# Vivado block design counter_4, xc7a35tcpg236-1, Vivado 2019.1
# (continued, part 2 of 2)
current_bd_instance /JK_FF_2/DFF/nand_3_1
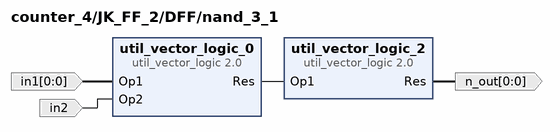
[diagram p24: block diagram inside /JK_FF_2/DFF/nand_3_1]
create_bd_pin -dir I -from 0 -to 0 in1
create_bd_pin -dir I in2
create_bd_pin -dir O -from 0 -to 0 n_out

create_bd_cell -type ip -vlnv xilinx.com:ip:util_vector_logic:2.0 util_vector_logic_0
set_property -dict {CONFIG.C_OPERATION and CONFIG.C_SIZE 1} [get_bd_cells util_vector_logic_0]
create_bd_cell -type ip -vlnv xilinx.com:ip:util_vector_logic:2.0 util_vector_logic_2
set_property -dict {CONFIG.C_OPERATION not CONFIG.C_SIZE 1} [get_bd_cells util_vector_logic_2]

# ---- hierarchy /JK_FF_2/DFF/nand_3_2 ----
current_bd_instance /JK_FF_2/DFF/nand_3_2
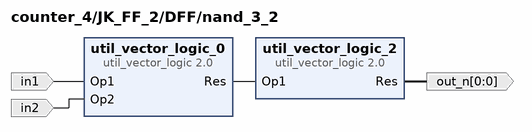
[diagram p25: block diagram inside /JK_FF_2/DFF/nand_3_2]
create_bd_pin -dir I in1
create_bd_pin -dir I in2
create_bd_pin -dir O -from 0 -to 0 out_n

create_bd_cell -type ip -vlnv xilinx.com:ip:util_vector_logic:2.0 util_vector_logic_0
set_property -dict {CONFIG.C_OPERATION and CONFIG.C_SIZE 1} [get_bd_cells util_vector_logic_0]
create_bd_cell -type ip -vlnv xilinx.com:ip:util_vector_logic:2.0 util_vector_logic_2
set_property -dict {CONFIG.C_OPERATION not CONFIG.C_SIZE 1} [get_bd_cells util_vector_logic_2]

# ---- hierarchy /JK_FF_2/DFF/nand_3_3 ----
current_bd_instance /JK_FF_2/DFF/nand_3_3
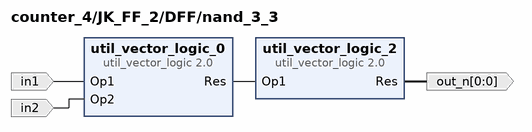
[diagram p26: block diagram inside /JK_FF_2/DFF/nand_3_3]
create_bd_pin -dir I in1
create_bd_pin -dir I in2
create_bd_pin -dir O -from 0 -to 0 out_n

create_bd_cell -type ip -vlnv xilinx.com:ip:util_vector_logic:2.0 util_vector_logic_0
set_property -dict {CONFIG.C_OPERATION and CONFIG.C_SIZE 1} [get_bd_cells util_vector_logic_0]
create_bd_cell -type ip -vlnv xilinx.com:ip:util_vector_logic:2.0 util_vector_logic_2
set_property -dict {CONFIG.C_OPERATION not CONFIG.C_SIZE 1} [get_bd_cells util_vector_logic_2]

# ---- hierarchy /JK_FF_2/DFF/nand_3_4 ----
current_bd_instance /JK_FF_2/DFF/nand_3_4
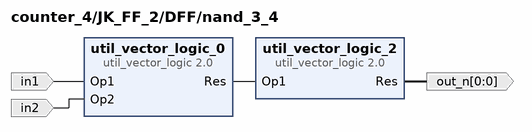
[diagram p27: block diagram inside /JK_FF_2/DFF/nand_3_4]
create_bd_pin -dir I in1
create_bd_pin -dir I in2
create_bd_pin -dir O -from 0 -to 0 out_n

create_bd_cell -type ip -vlnv xilinx.com:ip:util_vector_logic:2.0 util_vector_logic_0
set_property -dict {CONFIG.C_OPERATION and CONFIG.C_SIZE 1} [get_bd_cells util_vector_logic_0]
create_bd_cell -type ip -vlnv xilinx.com:ip:util_vector_logic:2.0 util_vector_logic_2
set_property -dict {CONFIG.C_OPERATION not CONFIG.C_SIZE 1} [get_bd_cells util_vector_logic_2]

# ---- hierarchy /JK_FF_2/DFF/nand_3_5 ----
current_bd_instance /JK_FF_2/DFF/nand_3_5
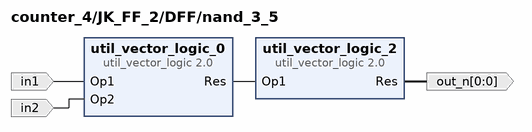
[diagram p28: block diagram inside /JK_FF_2/DFF/nand_3_5]
create_bd_pin -dir I in1
create_bd_pin -dir I in2
create_bd_pin -dir O -from 0 -to 0 out_n

create_bd_cell -type ip -vlnv xilinx.com:ip:util_vector_logic:2.0 util_vector_logic_0
set_property -dict {CONFIG.C_OPERATION and CONFIG.C_SIZE 1} [get_bd_cells util_vector_logic_0]
create_bd_cell -type ip -vlnv xilinx.com:ip:util_vector_logic:2.0 util_vector_logic_2
set_property -dict {CONFIG.C_OPERATION not CONFIG.C_SIZE 1} [get_bd_cells util_vector_logic_2]

# ---- hierarchy /JK_FF_2/DFF/nand_3_6 ----
current_bd_instance /JK_FF_2/DFF/nand_3_6
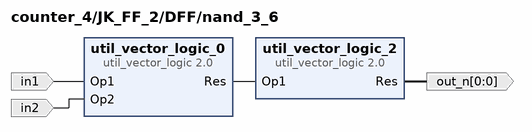
[diagram p29: block diagram inside /JK_FF_2/DFF/nand_3_6]
create_bd_pin -dir I in1
create_bd_pin -dir I in2
create_bd_pin -dir O -from 0 -to 0 out_n

create_bd_cell -type ip -vlnv xilinx.com:ip:util_vector_logic:2.0 util_vector_logic_0
set_property -dict {CONFIG.C_OPERATION and CONFIG.C_SIZE 1} [get_bd_cells util_vector_logic_0]
create_bd_cell -type ip -vlnv xilinx.com:ip:util_vector_logic:2.0 util_vector_logic_2
set_property -dict {CONFIG.C_OPERATION not CONFIG.C_SIZE 1} [get_bd_cells util_vector_logic_2]

# ---- hierarchy /JK_FF_2/DFF/nand_3_7 ----
current_bd_instance /JK_FF_2/DFF/nand_3_7
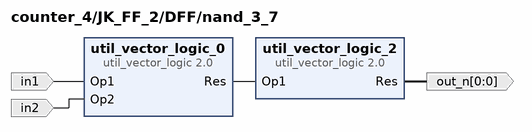
[diagram p30: block diagram inside /JK_FF_2/DFF/nand_3_7]
create_bd_pin -dir I in1
create_bd_pin -dir I in2
create_bd_pin -dir O -from 0 -to 0 out_n

create_bd_cell -type ip -vlnv xilinx.com:ip:util_vector_logic:2.0 util_vector_logic_0
set_property -dict {CONFIG.C_OPERATION and CONFIG.C_SIZE 1} [get_bd_cells util_vector_logic_0]
create_bd_cell -type ip -vlnv xilinx.com:ip:util_vector_logic:2.0 util_vector_logic_2
set_property -dict {CONFIG.C_OPERATION not CONFIG.C_SIZE 1} [get_bd_cells util_vector_logic_2]

# ---- hierarchy /JK_FF_3 ----
current_bd_instance /JK_FF_3
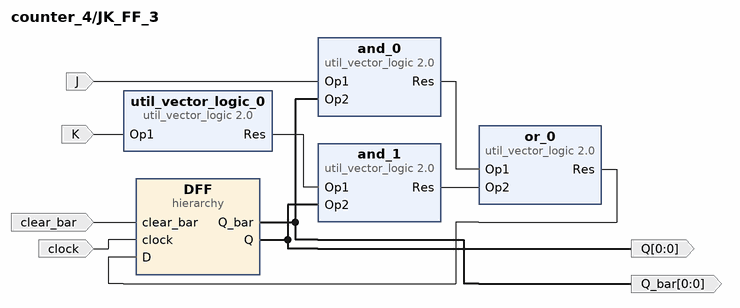
[diagram p31: block diagram inside /JK_FF_3]
create_bd_pin -dir I J
create_bd_pin -dir I K
create_bd_pin -dir I clock
create_bd_pin -dir I clear_bar
create_bd_pin -dir O -from 0 -to 0 Q
create_bd_pin -dir O -from 0 -to 0 Q_bar

create_bd_cell -type hier DFF
create_bd_cell -type ip -vlnv xilinx.com:ip:util_vector_logic:2.0 and_0
set_property -dict {CONFIG.C_SIZE 1} [get_bd_cells and_0]
create_bd_cell -type ip -vlnv xilinx.com:ip:util_vector_logic:2.0 or_0
set_property -dict {CONFIG.C_OPERATION or CONFIG.C_SIZE 1} [get_bd_cells or_0]
create_bd_cell -type ip -vlnv xilinx.com:ip:util_vector_logic:2.0 util_vector_logic_0
set_property -dict {CONFIG.C_OPERATION not CONFIG.C_SIZE 1} [get_bd_cells util_vector_logic_0]
create_bd_cell -type ip -vlnv xilinx.com:ip:util_vector_logic:2.0 and_1
set_property -dict {CONFIG.C_SIZE 1} [get_bd_cells and_1]

# ---- hierarchy /JK_FF_3/DFF ----
current_bd_instance /JK_FF_3/DFF
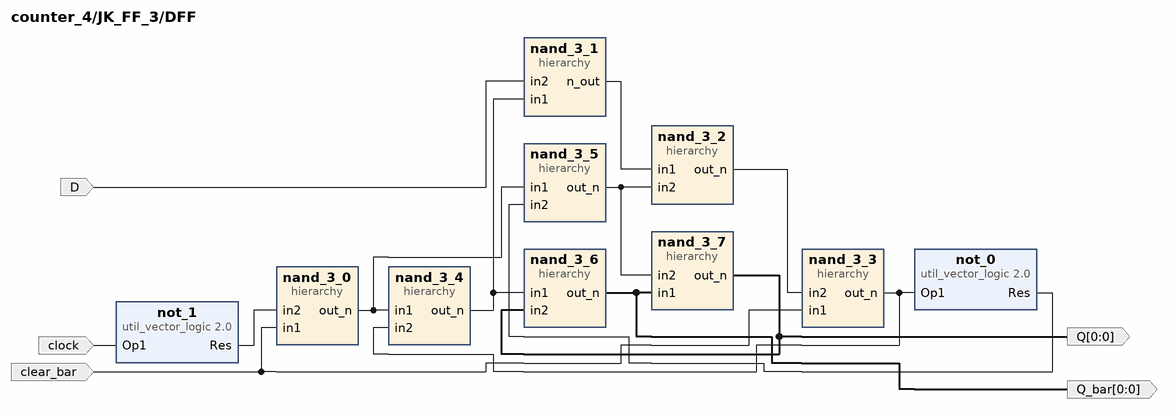
[diagram p32: block diagram inside /JK_FF_3/DFF]
create_bd_pin -dir I clear_bar
create_bd_pin -dir I clock
create_bd_pin -dir I D
create_bd_pin -dir O -from 0 -to 0 Q_bar
create_bd_pin -dir O -from 0 -to 0 Q

create_bd_cell -type hier nand_3_0
create_bd_cell -type hier nand_3_1
create_bd_cell -type ip -vlnv xilinx.com:ip:util_vector_logic:2.0 not_0
set_property -dict {CONFIG.C_OPERATION not CONFIG.C_SIZE 1} [get_bd_cells not_0]
create_bd_cell -type hier nand_3_2
create_bd_cell -type hier nand_3_3
create_bd_cell -type hier nand_3_4
create_bd_cell -type hier nand_3_5
create_bd_cell -type hier nand_3_6
create_bd_cell -type hier nand_3_7
create_bd_cell -type ip -vlnv xilinx.com:ip:util_vector_logic:2.0 not_1
set_property -dict {CONFIG.C_OPERATION not CONFIG.C_SIZE 1} [get_bd_cells not_1]

# ---- hierarchy /JK_FF_3/DFF/nand_3_0 ----
current_bd_instance /JK_FF_3/DFF/nand_3_0
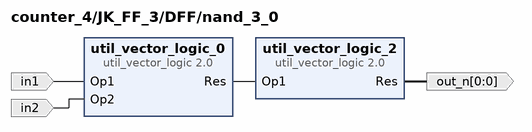
[diagram p33: block diagram inside /JK_FF_3/DFF/nand_3_0]
create_bd_pin -dir I in1
create_bd_pin -dir I in2
create_bd_pin -dir O -from 0 -to 0 out_n

create_bd_cell -type ip -vlnv xilinx.com:ip:util_vector_logic:2.0 util_vector_logic_0
set_property -dict {CONFIG.C_OPERATION and CONFIG.C_SIZE 1} [get_bd_cells util_vector_logic_0]
create_bd_cell -type ip -vlnv xilinx.com:ip:util_vector_logic:2.0 util_vector_logic_2
set_property -dict {CONFIG.C_OPERATION not CONFIG.C_SIZE 1} [get_bd_cells util_vector_logic_2]

# ---- hierarchy /JK_FF_3/DFF/nand_3_1 ----
current_bd_instance /JK_FF_3/DFF/nand_3_1
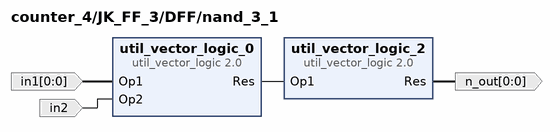
[diagram p34: block diagram inside /JK_FF_3/DFF/nand_3_1]
create_bd_pin -dir I -from 0 -to 0 in1
create_bd_pin -dir I in2
create_bd_pin -dir O -from 0 -to 0 n_out

create_bd_cell -type ip -vlnv xilinx.com:ip:util_vector_logic:2.0 util_vector_logic_0
set_property -dict {CONFIG.C_OPERATION and CONFIG.C_SIZE 1} [get_bd_cells util_vector_logic_0]
create_bd_cell -type ip -vlnv xilinx.com:ip:util_vector_logic:2.0 util_vector_logic_2
set_property -dict {CONFIG.C_OPERATION not CONFIG.C_SIZE 1} [get_bd_cells util_vector_logic_2]

# ---- hierarchy /JK_FF_3/DFF/nand_3_2 ----
current_bd_instance /JK_FF_3/DFF/nand_3_2
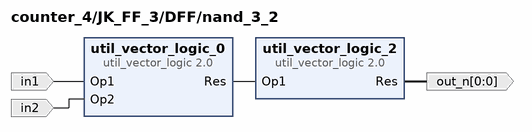
[diagram p35: block diagram inside /JK_FF_3/DFF/nand_3_2]
create_bd_pin -dir I in1
create_bd_pin -dir I in2
create_bd_pin -dir O -from 0 -to 0 out_n

create_bd_cell -type ip -vlnv xilinx.com:ip:util_vector_logic:2.0 util_vector_logic_0
set_property -dict {CONFIG.C_OPERATION and CONFIG.C_SIZE 1} [get_bd_cells util_vector_logic_0]
create_bd_cell -type ip -vlnv xilinx.com:ip:util_vector_logic:2.0 util_vector_logic_2
set_property -dict {CONFIG.C_OPERATION not CONFIG.C_SIZE 1} [get_bd_cells util_vector_logic_2]

# ---- hierarchy /JK_FF_3/DFF/nand_3_3 ----
current_bd_instance /JK_FF_3/DFF/nand_3_3
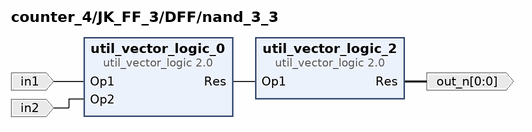
[diagram p36: block diagram inside /JK_FF_3/DFF/nand_3_3]
create_bd_pin -dir I in1
create_bd_pin -dir I in2
create_bd_pin -dir O -from 0 -to 0 out_n

create_bd_cell -type ip -vlnv xilinx.com:ip:util_vector_logic:2.0 util_vector_logic_0
set_property -dict {CONFIG.C_OPERATION and CONFIG.C_SIZE 1} [get_bd_cells util_vector_logic_0]
create_bd_cell -type ip -vlnv xilinx.com:ip:util_vector_logic:2.0 util_vector_logic_2
set_property -dict {CONFIG.C_OPERATION not CONFIG.C_SIZE 1} [get_bd_cells util_vector_logic_2]

# ---- hierarchy /JK_FF_3/DFF/nand_3_4 ----
current_bd_instance /JK_FF_3/DFF/nand_3_4
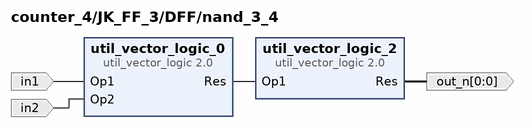
[diagram p37: block diagram inside /JK_FF_3/DFF/nand_3_4]
create_bd_pin -dir I in1
create_bd_pin -dir I in2
create_bd_pin -dir O -from 0 -to 0 out_n

create_bd_cell -type ip -vlnv xilinx.com:ip:util_vector_logic:2.0 util_vector_logic_0
set_property -dict {CONFIG.C_OPERATION and CONFIG.C_SIZE 1} [get_bd_cells util_vector_logic_0]
create_bd_cell -type ip -vlnv xilinx.com:ip:util_vector_logic:2.0 util_vector_logic_2
set_property -dict {CONFIG.C_OPERATION not CONFIG.C_SIZE 1} [get_bd_cells util_vector_logic_2]

# ---- hierarchy /JK_FF_3/DFF/nand_3_5 ----
current_bd_instance /JK_FF_3/DFF/nand_3_5
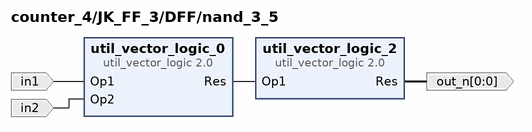
[diagram p38: block diagram inside /JK_FF_3/DFF/nand_3_5]
create_bd_pin -dir I in1
create_bd_pin -dir I in2
create_bd_pin -dir O -from 0 -to 0 out_n

create_bd_cell -type ip -vlnv xilinx.com:ip:util_vector_logic:2.0 util_vector_logic_0
set_property -dict {CONFIG.C_OPERATION and CONFIG.C_SIZE 1} [get_bd_cells util_vector_logic_0]
create_bd_cell -type ip -vlnv xilinx.com:ip:util_vector_logic:2.0 util_vector_logic_2
set_property -dict {CONFIG.C_OPERATION not CONFIG.C_SIZE 1} [get_bd_cells util_vector_logic_2]

# ---- hierarchy /JK_FF_3/DFF/nand_3_6 ----
current_bd_instance /JK_FF_3/DFF/nand_3_6
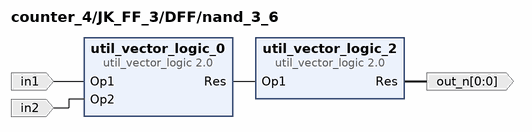
[diagram p39: block diagram inside /JK_FF_3/DFF/nand_3_6]
create_bd_pin -dir I in1
create_bd_pin -dir I in2
create_bd_pin -dir O -from 0 -to 0 out_n

create_bd_cell -type ip -vlnv xilinx.com:ip:util_vector_logic:2.0 util_vector_logic_0
set_property -dict {CONFIG.C_OPERATION and CONFIG.C_SIZE 1} [get_bd_cells util_vector_logic_0]
create_bd_cell -type ip -vlnv xilinx.com:ip:util_vector_logic:2.0 util_vector_logic_2
set_property -dict {CONFIG.C_OPERATION not CONFIG.C_SIZE 1} [get_bd_cells util_vector_logic_2]

# ---- hierarchy /JK_FF_3/DFF/nand_3_7 ----
current_bd_instance /JK_FF_3/DFF/nand_3_7
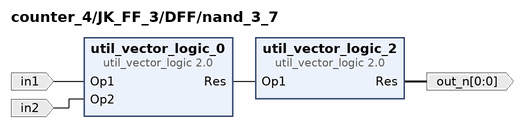
[diagram p40: block diagram inside /JK_FF_3/DFF/nand_3_7]
create_bd_pin -dir I in1
create_bd_pin -dir I in2
create_bd_pin -dir O -from 0 -to 0 out_n

create_bd_cell -type ip -vlnv xilinx.com:ip:util_vector_logic:2.0 util_vector_logic_0
set_property -dict {CONFIG.C_OPERATION and CONFIG.C_SIZE 1} [get_bd_cells util_vector_logic_0]
create_bd_cell -type ip -vlnv xilinx.com:ip:util_vector_logic:2.0 util_vector_logic_2
set_property -dict {CONFIG.C_OPERATION not CONFIG.C_SIZE 1} [get_bd_cells util_vector_logic_2]

# ---- connections ----

current_bd_instance /JK_FF_0
connect_bd_net [get_bd_pins clear_bar] [get_bd_pins DFF/clear_bar]
connect_bd_net [get_bd_pins clock] [get_bd_pins DFF/clock]
connect_bd_net [get_bd_pins J] [get_bd_pins and_0/Op1]
connect_bd_net [get_bd_pins DFF/Q_bar] [get_bd_pins and_0/Op2] [get_bd_pins Q_bar]
connect_bd_net [get_bd_pins and_0/Res] [get_bd_pins or_0/Op1]
connect_bd_net [get_bd_pins K] [get_bd_pins util_vector_logic_0/Op1]
connect_bd_net [get_bd_pins util_vector_logic_0/Res] [get_bd_pins and_1/Op1]
connect_bd_net [get_bd_pins DFF/Q] [get_bd_pins and_1/Op2] [get_bd_pins Q]
connect_bd_net [get_bd_pins and_1/Res] [get_bd_pins or_0/Op2]
connect_bd_net [get_bd_pins or_0/Res] [get_bd_pins DFF/D]

current_bd_instance /JK_FF_0/DFF
connect_bd_net [get_bd_pins clear_bar] [get_bd_pins nand_3_0/in1] [get_bd_pins nand_3_3/in1]
connect_bd_net [get_bd_pins D] [get_bd_pins nand_3_1/in2]
connect_bd_net [get_bd_pins nand_3_1/n_out] [get_bd_pins nand_3_2/in1]
connect_bd_net [get_bd_pins nand_3_2/out_n] [get_bd_pins nand_3_3/in2]
connect_bd_net [get_bd_pins nand_3_6/out_n] [get_bd_pins nand_3_7/in1] [get_bd_pins Q_bar]
connect_bd_net [get_bd_pins nand_3_7/out_n] [get_bd_pins nand_3_6/in2] [get_bd_pins Q]
connect_bd_net -net in1_1 [get_bd_pins nand_3_4/out_n] [get_bd_pins nand_3_6/in1] [get_bd_pins nand_3_1/in1]
connect_bd_net -net in2_1 [get_bd_pins nand_3_5/out_n] [get_bd_pins nand_3_7/in2] [get_bd_pins nand_3_2/in2]
connect_bd_net -net in1_2 [get_bd_pins nand_3_0/out_n] [get_bd_pins nand_3_4/in1] [get_bd_pins nand_3_5/in1]
connect_bd_net -net in2_2 [get_bd_pins not_0/Res] [get_bd_pins nand_3_5/in2]
connect_bd_net [get_bd_pins nand_3_3/out_n] [get_bd_pins not_0/Op1] [get_bd_pins nand_3_4/in2]
connect_bd_net -net util_vector_logic_0_Res [get_bd_pins not_1/Res] [get_bd_pins nand_3_0/in2]
connect_bd_net [get_bd_pins clock] [get_bd_pins not_1/Op1]

current_bd_instance /JK_FF_0/DFF/nand_3_0
connect_bd_net -net in1_1 [get_bd_pins in1] [get_bd_pins util_vector_logic_0/Op1]
connect_bd_net -net in2_1 [get_bd_pins in2] [get_bd_pins util_vector_logic_0/Op2]
connect_bd_net [get_bd_pins util_vector_logic_0/Res] [get_bd_pins util_vector_logic_2/Op1]
connect_bd_net [get_bd_pins util_vector_logic_2/Res] [get_bd_pins out_n]

current_bd_instance /JK_FF_0/DFF/nand_3_1
connect_bd_net -net in1_1 [get_bd_pins in1] [get_bd_pins util_vector_logic_0/Op1]
connect_bd_net -net in2_1 [get_bd_pins in2] [get_bd_pins util_vector_logic_0/Op2]
connect_bd_net [get_bd_pins util_vector_logic_0/Res] [get_bd_pins util_vector_logic_2/Op1]
connect_bd_net [get_bd_pins util_vector_logic_2/Res] [get_bd_pins n_out]

current_bd_instance /JK_FF_0/DFF/nand_3_2
connect_bd_net -net in1_1 [get_bd_pins in1] [get_bd_pins util_vector_logic_0/Op1]
connect_bd_net -net in2_1 [get_bd_pins in2] [get_bd_pins util_vector_logic_0/Op2]
connect_bd_net [get_bd_pins util_vector_logic_0/Res] [get_bd_pins util_vector_logic_2/Op1]
connect_bd_net [get_bd_pins util_vector_logic_2/Res] [get_bd_pins out_n]

current_bd_instance /JK_FF_0/DFF/nand_3_3
connect_bd_net -net in1_1 [get_bd_pins in1] [get_bd_pins util_vector_logic_0/Op1]
connect_bd_net -net in2_1 [get_bd_pins in2] [get_bd_pins util_vector_logic_0/Op2]
connect_bd_net [get_bd_pins util_vector_logic_0/Res] [get_bd_pins util_vector_logic_2/Op1]
connect_bd_net [get_bd_pins util_vector_logic_2/Res] [get_bd_pins out_n]

current_bd_instance /JK_FF_0/DFF/nand_3_4
connect_bd_net -net in1_1 [get_bd_pins in1] [get_bd_pins util_vector_logic_0/Op1]
connect_bd_net -net in2_1 [get_bd_pins in2] [get_bd_pins util_vector_logic_0/Op2]
connect_bd_net [get_bd_pins util_vector_logic_0/Res] [get_bd_pins util_vector_logic_2/Op1]
connect_bd_net [get_bd_pins util_vector_logic_2/Res] [get_bd_pins out_n]

current_bd_instance /JK_FF_0/DFF/nand_3_5
connect_bd_net -net in1_1 [get_bd_pins in1] [get_bd_pins util_vector_logic_0/Op1]
connect_bd_net -net in2_1 [get_bd_pins in2] [get_bd_pins util_vector_logic_0/Op2]
connect_bd_net [get_bd_pins util_vector_logic_0/Res] [get_bd_pins util_vector_logic_2/Op1]
connect_bd_net [get_bd_pins util_vector_logic_2/Res] [get_bd_pins out_n]

current_bd_instance /JK_FF_0/DFF/nand_3_6
connect_bd_net -net in1_1 [get_bd_pins in1] [get_bd_pins util_vector_logic_0/Op1]
connect_bd_net -net in2_1 [get_bd_pins in2] [get_bd_pins util_vector_logic_0/Op2]
connect_bd_net [get_bd_pins util_vector_logic_0/Res] [get_bd_pins util_vector_logic_2/Op1]
connect_bd_net [get_bd_pins util_vector_logic_2/Res] [get_bd_pins out_n]

current_bd_instance /JK_FF_0/DFF/nand_3_7
connect_bd_net -net in1_1 [get_bd_pins in1] [get_bd_pins util_vector_logic_0/Op1]
connect_bd_net -net in2_1 [get_bd_pins in2] [get_bd_pins util_vector_logic_0/Op2]
connect_bd_net [get_bd_pins util_vector_logic_0/Res] [get_bd_pins util_vector_logic_2/Op1]
connect_bd_net [get_bd_pins util_vector_logic_2/Res] [get_bd_pins out_n]

current_bd_instance /JK_FF_1
connect_bd_net [get_bd_pins clear_bar] [get_bd_pins DFF/clear_bar]
connect_bd_net [get_bd_pins clock] [get_bd_pins DFF/clock]
connect_bd_net [get_bd_pins J] [get_bd_pins and_0/Op1]
connect_bd_net [get_bd_pins DFF/Q_bar] [get_bd_pins and_0/Op2] [get_bd_pins Q_bar]
connect_bd_net [get_bd_pins and_0/Res] [get_bd_pins or_0/Op1]
connect_bd_net [get_bd_pins K] [get_bd_pins util_vector_logic_0/Op1]
connect_bd_net [get_bd_pins util_vector_logic_0/Res] [get_bd_pins and_1/Op1]
connect_bd_net [get_bd_pins DFF/Q] [get_bd_pins and_1/Op2] [get_bd_pins Q]
connect_bd_net [get_bd_pins and_1/Res] [get_bd_pins or_0/Op2]
connect_bd_net [get_bd_pins or_0/Res] [get_bd_pins DFF/D]

current_bd_instance /JK_FF_1/DFF
connect_bd_net [get_bd_pins clear_bar] [get_bd_pins nand_3_0/in1] [get_bd_pins nand_3_3/in1]
connect_bd_net [get_bd_pins D] [get_bd_pins nand_3_1/in2]
connect_bd_net [get_bd_pins nand_3_1/n_out] [get_bd_pins nand_3_2/in1]
connect_bd_net [get_bd_pins nand_3_2/out_n] [get_bd_pins nand_3_3/in2]
connect_bd_net [get_bd_pins nand_3_6/out_n] [get_bd_pins nand_3_7/in1] [get_bd_pins Q_bar]
connect_bd_net [get_bd_pins nand_3_7/out_n] [get_bd_pins nand_3_6/in2] [get_bd_pins Q]
connect_bd_net -net in1_1 [get_bd_pins nand_3_4/out_n] [get_bd_pins nand_3_6/in1] [get_bd_pins nand_3_1/in1]
connect_bd_net -net in2_1 [get_bd_pins nand_3_5/out_n] [get_bd_pins nand_3_7/in2] [get_bd_pins nand_3_2/in2]
connect_bd_net -net in1_2 [get_bd_pins nand_3_0/out_n] [get_bd_pins nand_3_4/in1] [get_bd_pins nand_3_5/in1]
connect_bd_net -net in2_2 [get_bd_pins not_0/Res] [get_bd_pins nand_3_5/in2]
connect_bd_net [get_bd_pins nand_3_3/out_n] [get_bd_pins not_0/Op1] [get_bd_pins nand_3_4/in2]
connect_bd_net -net util_vector_logic_0_Res [get_bd_pins not_1/Res] [get_bd_pins nand_3_0/in2]
connect_bd_net [get_bd_pins clock] [get_bd_pins not_1/Op1]

current_bd_instance /JK_FF_1/DFF/nand_3_0
connect_bd_net -net in1_1 [get_bd_pins in1] [get_bd_pins util_vector_logic_0/Op1]
connect_bd_net -net in2_1 [get_bd_pins in2] [get_bd_pins util_vector_logic_0/Op2]
connect_bd_net [get_bd_pins util_vector_logic_0/Res] [get_bd_pins util_vector_logic_2/Op1]
connect_bd_net [get_bd_pins util_vector_logic_2/Res] [get_bd_pins out_n]

current_bd_instance /JK_FF_1/DFF/nand_3_1
connect_bd_net -net in1_1 [get_bd_pins in1] [get_bd_pins util_vector_logic_0/Op1]
connect_bd_net -net in2_1 [get_bd_pins in2] [get_bd_pins util_vector_logic_0/Op2]
connect_bd_net [get_bd_pins util_vector_logic_0/Res] [get_bd_pins util_vector_logic_2/Op1]
connect_bd_net [get_bd_pins util_vector_logic_2/Res] [get_bd_pins n_out]

current_bd_instance /JK_FF_1/DFF/nand_3_2
connect_bd_net -net in1_1 [get_bd_pins in1] [get_bd_pins util_vector_logic_0/Op1]
connect_bd_net -net in2_1 [get_bd_pins in2] [get_bd_pins util_vector_logic_0/Op2]
connect_bd_net [get_bd_pins util_vector_logic_0/Res] [get_bd_pins util_vector_logic_2/Op1]
connect_bd_net [get_bd_pins util_vector_logic_2/Res] [get_bd_pins out_n]

current_bd_instance /JK_FF_1/DFF/nand_3_3
connect_bd_net -net in1_1 [get_bd_pins in1] [get_bd_pins util_vector_logic_0/Op1]
connect_bd_net -net in2_1 [get_bd_pins in2] [get_bd_pins util_vector_logic_0/Op2]
connect_bd_net [get_bd_pins util_vector_logic_0/Res] [get_bd_pins util_vector_logic_2/Op1]
connect_bd_net [get_bd_pins util_vector_logic_2/Res] [get_bd_pins out_n]

current_bd_instance /JK_FF_1/DFF/nand_3_4
connect_bd_net -net in1_1 [get_bd_pins in1] [get_bd_pins util_vector_logic_0/Op1]
connect_bd_net -net in2_1 [get_bd_pins in2] [get_bd_pins util_vector_logic_0/Op2]
connect_bd_net [get_bd_pins util_vector_logic_0/Res] [get_bd_pins util_vector_logic_2/Op1]
connect_bd_net [get_bd_pins util_vector_logic_2/Res] [get_bd_pins out_n]

current_bd_instance /JK_FF_1/DFF/nand_3_5
connect_bd_net -net in1_1 [get_bd_pins in1] [get_bd_pins util_vector_logic_0/Op1]
connect_bd_net -net in2_1 [get_bd_pins in2] [get_bd_pins util_vector_logic_0/Op2]
connect_bd_net [get_bd_pins util_vector_logic_0/Res] [get_bd_pins util_vector_logic_2/Op1]
connect_bd_net [get_bd_pins util_vector_logic_2/Res] [get_bd_pins out_n]

current_bd_instance /JK_FF_1/DFF/nand_3_6
connect_bd_net -net in1_1 [get_bd_pins in1] [get_bd_pins util_vector_logic_0/Op1]
connect_bd_net -net in2_1 [get_bd_pins in2] [get_bd_pins util_vector_logic_0/Op2]
connect_bd_net [get_bd_pins util_vector_logic_0/Res] [get_bd_pins util_vector_logic_2/Op1]
connect_bd_net [get_bd_pins util_vector_logic_2/Res] [get_bd_pins out_n]

current_bd_instance /JK_FF_1/DFF/nand_3_7
connect_bd_net -net in1_1 [get_bd_pins in1] [get_bd_pins util_vector_logic_0/Op1]
connect_bd_net -net in2_1 [get_bd_pins in2] [get_bd_pins util_vector_logic_0/Op2]
connect_bd_net [get_bd_pins util_vector_logic_0/Res] [get_bd_pins util_vector_logic_2/Op1]
connect_bd_net [get_bd_pins util_vector_logic_2/Res] [get_bd_pins out_n]

current_bd_instance /JK_FF_2
connect_bd_net [get_bd_pins clear_bar] [get_bd_pins DFF/clear_bar]
connect_bd_net [get_bd_pins clock] [get_bd_pins DFF/clock]
connect_bd_net [get_bd_pins J] [get_bd_pins and_0/Op1]
connect_bd_net [get_bd_pins DFF/Q_bar] [get_bd_pins and_0/Op2] [get_bd_pins Q_bar]
connect_bd_net [get_bd_pins and_0/Res] [get_bd_pins or_0/Op1]
connect_bd_net [get_bd_pins K] [get_bd_pins util_vector_logic_0/Op1]
connect_bd_net [get_bd_pins util_vector_logic_0/Res] [get_bd_pins and_1/Op1]
connect_bd_net [get_bd_pins DFF/Q] [get_bd_pins and_1/Op2] [get_bd_pins Q]
connect_bd_net [get_bd_pins and_1/Res] [get_bd_pins or_0/Op2]
connect_bd_net [get_bd_pins or_0/Res] [get_bd_pins DFF/D]

current_bd_instance /JK_FF_2/DFF
connect_bd_net [get_bd_pins clear_bar] [get_bd_pins nand_3_0/in1] [get_bd_pins nand_3_3/in1]
connect_bd_net [get_bd_pins D] [get_bd_pins nand_3_1/in2]
connect_bd_net [get_bd_pins nand_3_1/n_out] [get_bd_pins nand_3_2/in1]
connect_bd_net [get_bd_pins nand_3_2/out_n] [get_bd_pins nand_3_3/in2]
connect_bd_net [get_bd_pins nand_3_6/out_n] [get_bd_pins nand_3_7/in1] [get_bd_pins Q_bar]
connect_bd_net [get_bd_pins nand_3_7/out_n] [get_bd_pins nand_3_6/in2] [get_bd_pins Q]
connect_bd_net -net in1_1 [get_bd_pins nand_3_4/out_n] [get_bd_pins nand_3_6/in1] [get_bd_pins nand_3_1/in1]
connect_bd_net -net in2_1 [get_bd_pins nand_3_5/out_n] [get_bd_pins nand_3_7/in2] [get_bd_pins nand_3_2/in2]
connect_bd_net -net in1_2 [get_bd_pins nand_3_0/out_n] [get_bd_pins nand_3_4/in1] [get_bd_pins nand_3_5/in1]
connect_bd_net -net in2_2 [get_bd_pins not_0/Res] [get_bd_pins nand_3_5/in2]
connect_bd_net [get_bd_pins nand_3_3/out_n] [get_bd_pins not_0/Op1] [get_bd_pins nand_3_4/in2]
connect_bd_net -net util_vector_logic_0_Res [get_bd_pins not_1/Res] [get_bd_pins nand_3_0/in2]
connect_bd_net [get_bd_pins clock] [get_bd_pins not_1/Op1]

current_bd_instance /JK_FF_2/DFF/nand_3_0
connect_bd_net -net in1_1 [get_bd_pins in1] [get_bd_pins util_vector_logic_0/Op1]
connect_bd_net -net in2_1 [get_bd_pins in2] [get_bd_pins util_vector_logic_0/Op2]
connect_bd_net [get_bd_pins util_vector_logic_0/Res] [get_bd_pins util_vector_logic_2/Op1]
connect_bd_net [get_bd_pins util_vector_logic_2/Res] [get_bd_pins out_n]

current_bd_instance /JK_FF_2/DFF/nand_3_1
connect_bd_net -net in1_1 [get_bd_pins in1] [get_bd_pins util_vector_logic_0/Op1]
connect_bd_net -net in2_1 [get_bd_pins in2] [get_bd_pins util_vector_logic_0/Op2]
connect_bd_net [get_bd_pins util_vector_logic_0/Res] [get_bd_pins util_vector_logic_2/Op1]
connect_bd_net [get_bd_pins util_vector_logic_2/Res] [get_bd_pins n_out]

current_bd_instance /JK_FF_2/DFF/nand_3_2
connect_bd_net -net in1_1 [get_bd_pins in1] [get_bd_pins util_vector_logic_0/Op1]
connect_bd_net -net in2_1 [get_bd_pins in2] [get_bd_pins util_vector_logic_0/Op2]
connect_bd_net [get_bd_pins util_vector_logic_0/Res] [get_bd_pins util_vector_logic_2/Op1]
connect_bd_net [get_bd_pins util_vector_logic_2/Res] [get_bd_pins out_n]

current_bd_instance /JK_FF_2/DFF/nand_3_3
connect_bd_net -net in1_1 [get_bd_pins in1] [get_bd_pins util_vector_logic_0/Op1]
connect_bd_net -net in2_1 [get_bd_pins in2] [get_bd_pins util_vector_logic_0/Op2]
connect_bd_net [get_bd_pins util_vector_logic_0/Res] [get_bd_pins util_vector_logic_2/Op1]
connect_bd_net [get_bd_pins util_vector_logic_2/Res] [get_bd_pins out_n]

current_bd_instance /JK_FF_2/DFF/nand_3_4
connect_bd_net -net in1_1 [get_bd_pins in1] [get_bd_pins util_vector_logic_0/Op1]
connect_bd_net -net in2_1 [get_bd_pins in2] [get_bd_pins util_vector_logic_0/Op2]
connect_bd_net [get_bd_pins util_vector_logic_0/Res] [get_bd_pins util_vector_logic_2/Op1]
connect_bd_net [get_bd_pins util_vector_logic_2/Res] [get_bd_pins out_n]

current_bd_instance /JK_FF_2/DFF/nand_3_5
connect_bd_net -net in1_1 [get_bd_pins in1] [get_bd_pins util_vector_logic_0/Op1]
connect_bd_net -net in2_1 [get_bd_pins in2] [get_bd_pins util_vector_logic_0/Op2]
connect_bd_net [get_bd_pins util_vector_logic_0/Res] [get_bd_pins util_vector_logic_2/Op1]
connect_bd_net [get_bd_pins util_vector_logic_2/Res] [get_bd_pins out_n]

current_bd_instance /JK_FF_2/DFF/nand_3_6
connect_bd_net -net in1_1 [get_bd_pins in1] [get_bd_pins util_vector_logic_0/Op1]
connect_bd_net -net in2_1 [get_bd_pins in2] [get_bd_pins util_vector_logic_0/Op2]
connect_bd_net [get_bd_pins util_vector_logic_0/Res] [get_bd_pins util_vector_logic_2/Op1]
connect_bd_net [get_bd_pins util_vector_logic_2/Res] [get_bd_pins out_n]

current_bd_instance /JK_FF_2/DFF/nand_3_7
connect_bd_net -net in1_1 [get_bd_pins in1] [get_bd_pins util_vector_logic_0/Op1]
connect_bd_net -net in2_1 [get_bd_pins in2] [get_bd_pins util_vector_logic_0/Op2]
connect_bd_net [get_bd_pins util_vector_logic_0/Res] [get_bd_pins util_vector_logic_2/Op1]
connect_bd_net [get_bd_pins util_vector_logic_2/Res] [get_bd_pins out_n]

current_bd_instance /JK_FF_3
connect_bd_net [get_bd_pins clear_bar] [get_bd_pins DFF/clear_bar]
connect_bd_net [get_bd_pins clock] [get_bd_pins DFF/clock]
connect_bd_net [get_bd_pins J] [get_bd_pins and_0/Op1]
connect_bd_net [get_bd_pins DFF/Q_bar] [get_bd_pins and_0/Op2] [get_bd_pins Q_bar]
connect_bd_net [get_bd_pins and_0/Res] [get_bd_pins or_0/Op1]
connect_bd_net [get_bd_pins K] [get_bd_pins util_vector_logic_0/Op1]
connect_bd_net [get_bd_pins util_vector_logic_0/Res] [get_bd_pins and_1/Op1]
connect_bd_net [get_bd_pins DFF/Q] [get_bd_pins and_1/Op2] [get_bd_pins Q]
connect_bd_net [get_bd_pins and_1/Res] [get_bd_pins or_0/Op2]
connect_bd_net [get_bd_pins or_0/Res] [get_bd_pins DFF/D]

current_bd_instance /JK_FF_3/DFF
connect_bd_net [get_bd_pins clear_bar] [get_bd_pins nand_3_0/in1] [get_bd_pins nand_3_3/in1]
connect_bd_net [get_bd_pins D] [get_bd_pins nand_3_1/in2]
connect_bd_net [get_bd_pins nand_3_1/n_out] [get_bd_pins nand_3_2/in1]
connect_bd_net [get_bd_pins nand_3_2/out_n] [get_bd_pins nand_3_3/in2]
connect_bd_net [get_bd_pins nand_3_6/out_n] [get_bd_pins nand_3_7/in1] [get_bd_pins Q_bar]
connect_bd_net [get_bd_pins nand_3_7/out_n] [get_bd_pins nand_3_6/in2] [get_bd_pins Q]
connect_bd_net -net in1_1 [get_bd_pins nand_3_4/out_n] [get_bd_pins nand_3_6/in1] [get_bd_pins nand_3_1/in1]
connect_bd_net -net in2_1 [get_bd_pins nand_3_5/out_n] [get_bd_pins nand_3_7/in2] [get_bd_pins nand_3_2/in2]
connect_bd_net -net in1_2 [get_bd_pins nand_3_0/out_n] [get_bd_pins nand_3_4/in1] [get_bd_pins nand_3_5/in1]
connect_bd_net -net in2_2 [get_bd_pins not_0/Res] [get_bd_pins nand_3_5/in2]
connect_bd_net [get_bd_pins nand_3_3/out_n] [get_bd_pins not_0/Op1] [get_bd_pins nand_3_4/in2]
connect_bd_net -net util_vector_logic_0_Res [get_bd_pins not_1/Res] [get_bd_pins nand_3_0/in2]
connect_bd_net [get_bd_pins clock] [get_bd_pins not_1/Op1]

current_bd_instance /JK_FF_3/DFF/nand_3_0
connect_bd_net -net in1_1 [get_bd_pins in1] [get_bd_pins util_vector_logic_0/Op1]
connect_bd_net -net in2_1 [get_bd_pins in2] [get_bd_pins util_vector_logic_0/Op2]
connect_bd_net [get_bd_pins util_vector_logic_0/Res] [get_bd_pins util_vector_logic_2/Op1]
connect_bd_net [get_bd_pins util_vector_logic_2/Res] [get_bd_pins out_n]

current_bd_instance /JK_FF_3/DFF/nand_3_1
connect_bd_net -net in1_1 [get_bd_pins in1] [get_bd_pins util_vector_logic_0/Op1]
connect_bd_net -net in2_1 [get_bd_pins in2] [get_bd_pins util_vector_logic_0/Op2]
connect_bd_net [get_bd_pins util_vector_logic_0/Res] [get_bd_pins util_vector_logic_2/Op1]
connect_bd_net [get_bd_pins util_vector_logic_2/Res] [get_bd_pins n_out]

current_bd_instance /JK_FF_3/DFF/nand_3_2
connect_bd_net -net in1_1 [get_bd_pins in1] [get_bd_pins util_vector_logic_0/Op1]
connect_bd_net -net in2_1 [get_bd_pins in2] [get_bd_pins util_vector_logic_0/Op2]
connect_bd_net [get_bd_pins util_vector_logic_0/Res] [get_bd_pins util_vector_logic_2/Op1]
connect_bd_net [get_bd_pins util_vector_logic_2/Res] [get_bd_pins out_n]

current_bd_instance /JK_FF_3/DFF/nand_3_3
connect_bd_net -net in1_1 [get_bd_pins in1] [get_bd_pins util_vector_logic_0/Op1]
connect_bd_net -net in2_1 [get_bd_pins in2] [get_bd_pins util_vector_logic_0/Op2]
connect_bd_net [get_bd_pins util_vector_logic_0/Res] [get_bd_pins util_vector_logic_2/Op1]
connect_bd_net [get_bd_pins util_vector_logic_2/Res] [get_bd_pins out_n]

current_bd_instance /JK_FF_3/DFF/nand_3_4
connect_bd_net -net in1_1 [get_bd_pins in1] [get_bd_pins util_vector_logic_0/Op1]
connect_bd_net -net in2_1 [get_bd_pins in2] [get_bd_pins util_vector_logic_0/Op2]
connect_bd_net [get_bd_pins util_vector_logic_0/Res] [get_bd_pins util_vector_logic_2/Op1]
connect_bd_net [get_bd_pins util_vector_logic_2/Res] [get_bd_pins out_n]

current_bd_instance /JK_FF_3/DFF/nand_3_5
connect_bd_net -net in1_1 [get_bd_pins in1] [get_bd_pins util_vector_logic_0/Op1]
connect_bd_net -net in2_1 [get_bd_pins in2] [get_bd_pins util_vector_logic_0/Op2]
connect_bd_net [get_bd_pins util_vector_logic_0/Res] [get_bd_pins util_vector_logic_2/Op1]
connect_bd_net [get_bd_pins util_vector_logic_2/Res] [get_bd_pins out_n]

current_bd_instance /JK_FF_3/DFF/nand_3_6
connect_bd_net -net in1_1 [get_bd_pins in1] [get_bd_pins util_vector_logic_0/Op1]
connect_bd_net -net in2_1 [get_bd_pins in2] [get_bd_pins util_vector_logic_0/Op2]
connect_bd_net [get_bd_pins util_vector_logic_0/Res] [get_bd_pins util_vector_logic_2/Op1]
connect_bd_net [get_bd_pins util_vector_logic_2/Res] [get_bd_pins out_n]

current_bd_instance /JK_FF_3/DFF/nand_3_7
connect_bd_net -net in1_1 [get_bd_pins in1] [get_bd_pins util_vector_logic_0/Op1]
connect_bd_net -net in2_1 [get_bd_pins in2] [get_bd_pins util_vector_logic_0/Op2]
connect_bd_net [get_bd_pins util_vector_logic_0/Res] [get_bd_pins util_vector_logic_2/Op1]
connect_bd_net [get_bd_pins util_vector_logic_2/Res] [get_bd_pins out_n]

current_bd_instance /
connect_bd_net [get_bd_ports clear_bar] \
  [get_bd_pins xor_0/Op2] [get_bd_pins xor_0/Op1] [get_bd_pins JK_FF_0/clear_bar] [get_bd_pins JK_FF_1/clear_bar] \
  [get_bd_pins JK_FF_2/clear_bar] [get_bd_pins JK_FF_3/clear_bar]
connect_bd_net -net util_vector_logic_0_Res [get_bd_pins xor_0/Res] [get_bd_pins not_0/Op1]
connect_bd_net [get_bd_ports U] [get_bd_pins and_0/Op1] [get_bd_pins not_1/Op1]
connect_bd_net [get_bd_pins JK_FF_0/Q] [get_bd_pins and_0/Op2] [get_bd_ports Q0]
connect_bd_net [get_bd_pins not_1/Res] [get_bd_pins and_1/Op2]
connect_bd_net [get_bd_pins JK_FF_0/Q_bar] [get_bd_pins and_1/Op1]
connect_bd_net [get_bd_pins and_0/Res] [get_bd_pins or_0/Op1] [get_bd_pins and_2/Op1]
connect_bd_net [get_bd_pins and_1/Res] [get_bd_pins or_0/Op2] [get_bd_pins and_3/Op2]
connect_bd_net [get_bd_pins JK_FF_1/Q] [get_bd_pins and_2/Op2] [get_bd_ports Q1]
connect_bd_net [get_bd_pins JK_FF_1/Q_bar] [get_bd_pins and_3/Op1]
connect_bd_net [get_bd_pins and_2/Res] [get_bd_pins or_1/Op1] [get_bd_pins and_4/Op1]
connect_bd_net [get_bd_pins and_3/Res] [get_bd_pins or_1/Op2] [get_bd_pins and_5/Op2]
connect_bd_net [get_bd_ports clock] [get_bd_pins JK_FF_0/clock] [get_bd_pins JK_FF_1/clock] [get_bd_pins JK_FF_2/clock] [get_bd_pins JK_FF_3/clock]
connect_bd_net [get_bd_pins JK_FF_2/Q] [get_bd_pins and_4/Op2] [get_bd_ports Q2]
connect_bd_net [get_bd_pins JK_FF_2/Q_bar] [get_bd_pins and_5/Op1]
connect_bd_net [get_bd_pins and_4/Res] [get_bd_pins or_2/Op1]
connect_bd_net [get_bd_pins and_5/Res] [get_bd_pins or_2/Op2]
connect_bd_net [get_bd_pins JK_FF_3/Q] [get_bd_ports Q3]
connect_bd_net [get_bd_ports Enable] [get_bd_pins and_6/Op2] [get_bd_pins and_7/Op2] [get_bd_pins and_8/Op2] [get_bd_pins and_9/Op2]
connect_bd_net [get_bd_pins not_0/Res] [get_bd_pins and_6/Op1]
connect_bd_net [get_bd_pins and_6/Res] [get_bd_pins JK_FF_0/J] [get_bd_pins JK_FF_0/K]
connect_bd_net [get_bd_pins or_0/Res] [get_bd_pins and_7/Op1]
connect_bd_net [get_bd_pins and_7/Res] [get_bd_pins JK_FF_1/J] [get_bd_pins JK_FF_1/K]
connect_bd_net [get_bd_pins or_1/Res] [get_bd_pins and_8/Op1]
connect_bd_net [get_bd_pins and_8/Res] [get_bd_pins JK_FF_2/K] [get_bd_pins JK_FF_2/J]
connect_bd_net [get_bd_pins or_2/Res] [get_bd_pins and_9/Op1]
connect_bd_net [get_bd_pins and_9/Res] [get_bd_pins JK_FF_3/J] [get_bd_pins JK_FF_3/K]

validate_bd_design
save_bd_design
